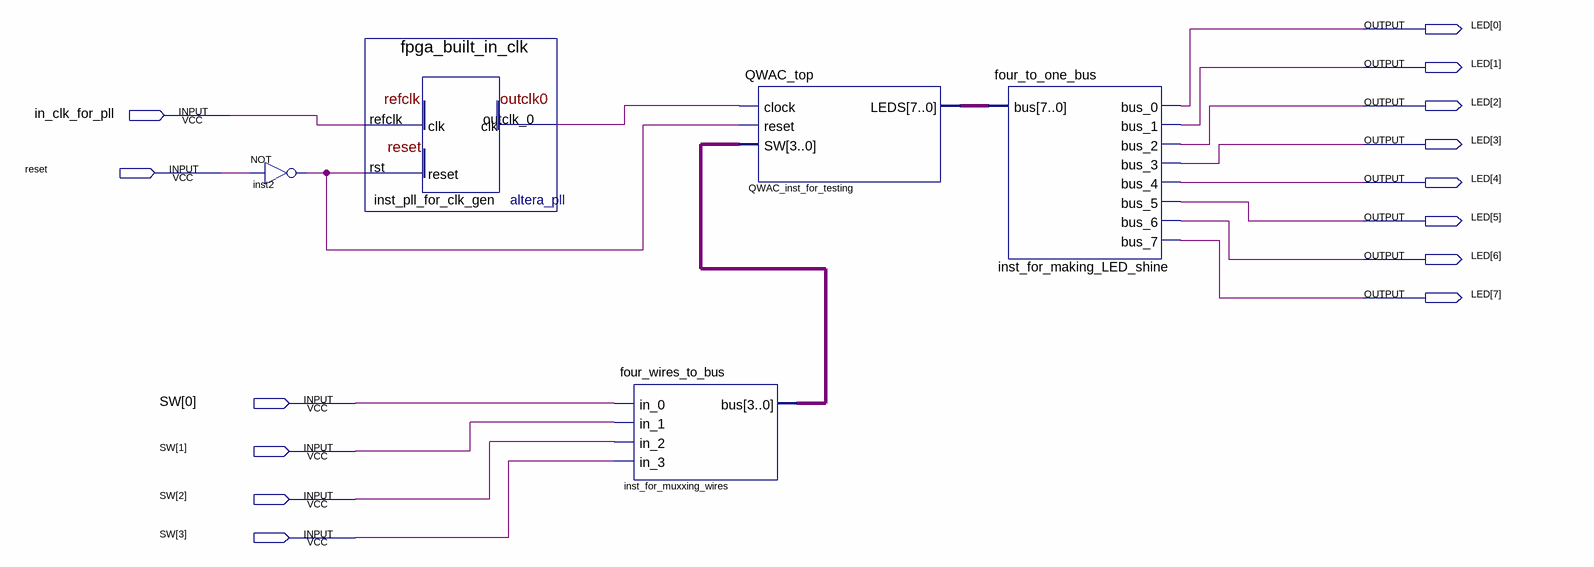
[diagram p0: schematic sheet]
// Quartus schematic QWAC.bdf as structural Verilog: 5 symbols, 14 pins
module QWAC (
  input  in_clk_for_pll,
  input  reset,
  input  [3:0] SW,
  output [7:0] LED
);

  wire inst2_out, inst_pll_for_clk_gen_outclk_0;
  wire [3:0] inst_for_muxxing_wires_bus;
  wire [7:0] QWAC_inst_for_testing_leds;

  not inst2 (inst2_out, reset);
  fpga_built_in_clk inst_pll_for_clk_gen (
    .refclk(in_clk_for_pll), .rst(inst2_out), .outclk_0(inst_pll_for_clk_gen_outclk_0));
  four_wires_to_bus inst_for_muxxing_wires (
    .in_0(SW[0]), .in_1(SW[1]), .in_2(SW[2]), .in_3(SW[3]), .bus(inst_for_muxxing_wires_bus));
  QWAC_top QWAC_inst_for_testing (
    .clock(inst_pll_for_clk_gen_outclk_0), .reset(inst2_out), .SW(inst_for_muxxing_wires_bus),
    .LEDS(QWAC_inst_for_testing_leds));
  four_to_one_bus inst_for_making_LED_shine (
    .bus(QWAC_inst_for_testing_leds), .bus_0(LED[0]), .bus_1(LED[1]), .bus_2(LED[2]), .bus_3(LED[3]),
    .bus_4(LED[4]), .bus_5(LED[5]), .bus_6(LED[6]), .bus_7(LED[7]));
endmodule
